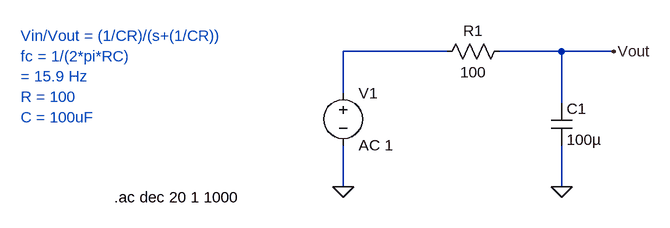
[diagram p0: schematic lowpassFilter.asc]
lowpassFilter.asc, the LTspice schematic file:
Version 4.1
SHEET 1 892 680
WIRE 560 112 400 112
WIRE 736 112 640 112
WIRE 816 112 736 112
WIRE 400 176 400 112
WIRE 736 192 736 112
WIRE 400 320 400 256
WIRE 736 320 736 256
FLAG 400 320 0
FLAG 736 320 0
FLAG 816 112 Vout
SYMBOL voltage 400 160 R0
SYMATTR InstName V1
SYMATTR Value AC 1
SYMBOL res 656 96 R90
WINDOW 0 0 56 VBottom 2
WINDOW 3 32 56 VTop 2
SYMATTR InstName R1
SYMATTR Value 100
SYMBOL cap 720 192 R0
SYMATTR InstName C1
SYMATTR Value 100µ
TEXT -96 88 Left 2 ;Vin/Vout = (1/CR)/(s+(1/CR))\nfc = 1/(2*pi*RC)\n= 15.9 Hz\nR = 100 \nC = 100uF
TEXT 48 336 Left 2 !.ac dec 20 1 1000

The netlist it stands for:
* lowpassFilter.asc
V1 N001 0 AC 1
R1 Vout N001 100
C1 Vout 0 100µ
* Vin/Vout = (1/CR)/(s+(1/CR))
* fc = 1/(2*pi*RC)
* = 15.9 Hz
* R = 100
* C = 100uF
.ac dec 20 1 1000
.backanno
.end